# EAGLE design Wireless_TempSens (EAGLE 9.6.2)
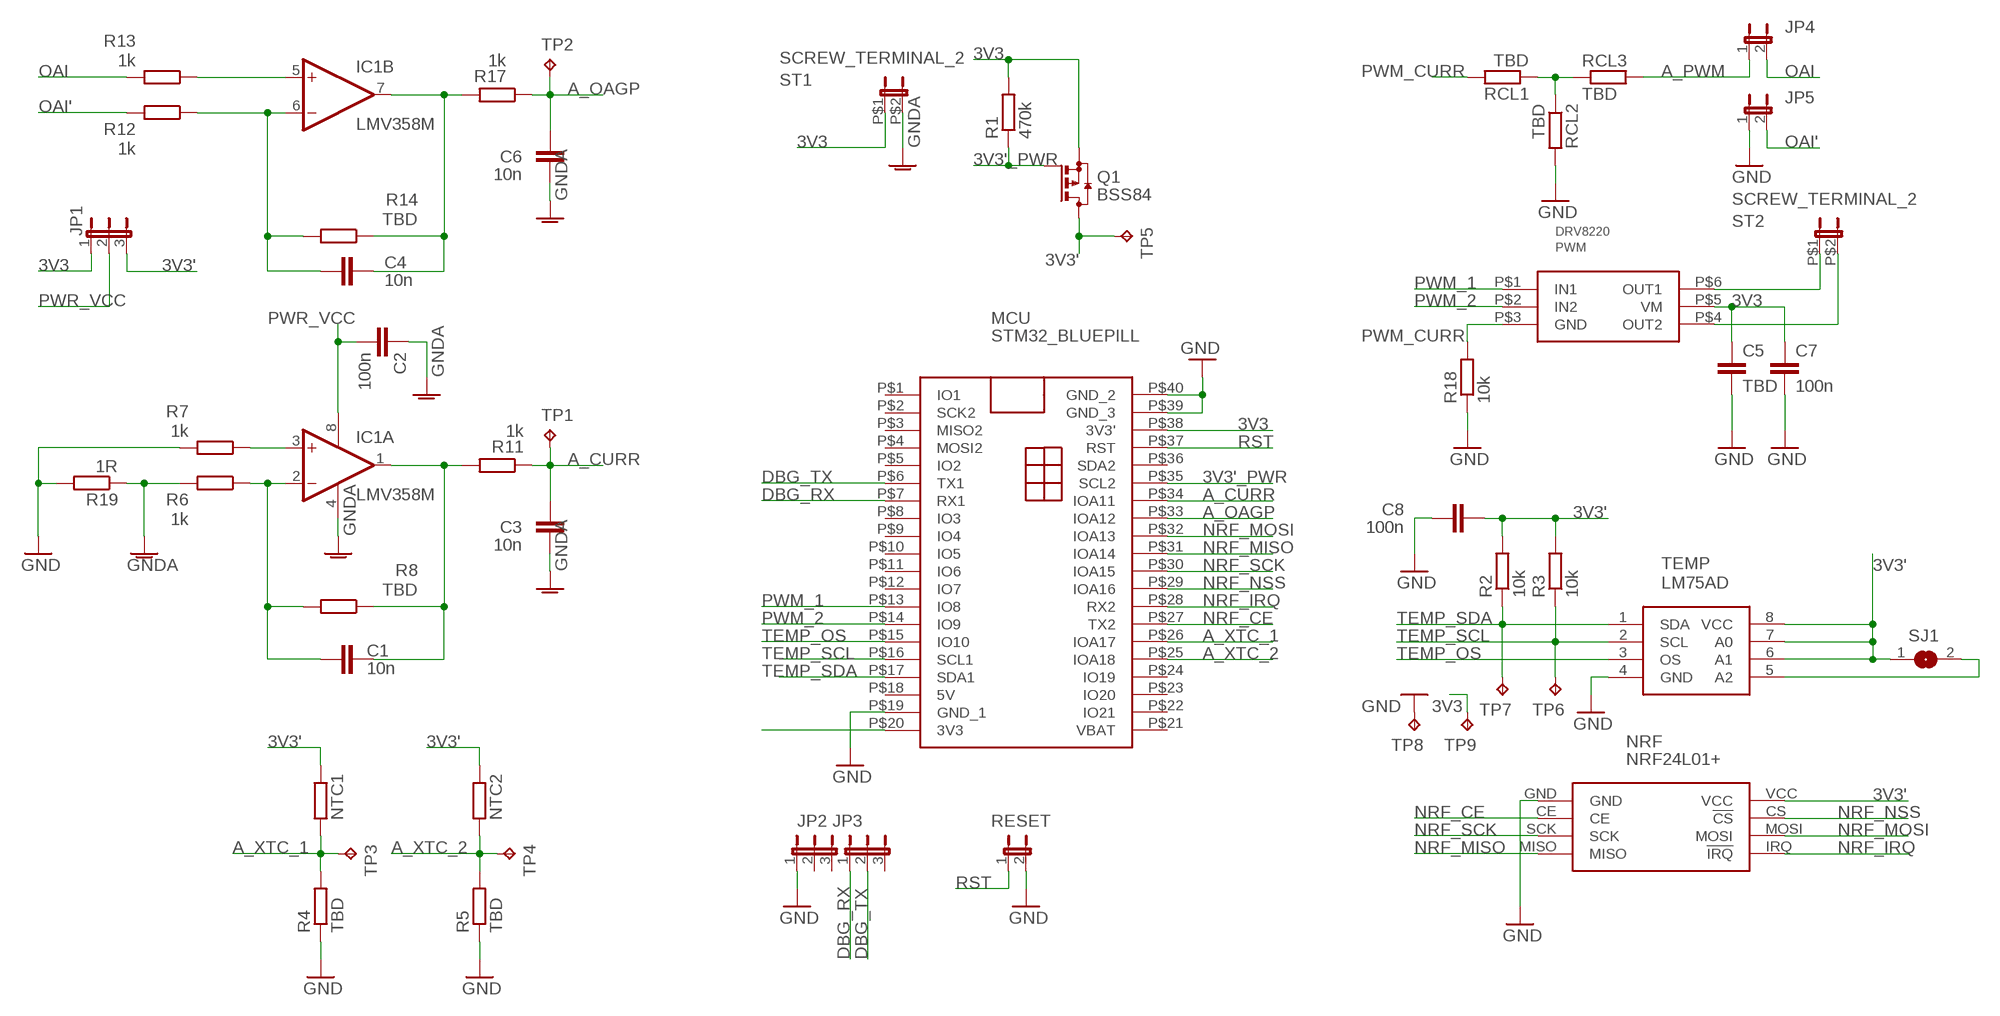
[diagram p0: schematic, sheet 1]

## Parts
C1  10n  C-EUC0805  [C0805]
C2  100n  C-EUC0805  [C0805]
C3  10n  C-EUC0805  [C0805]
C4  10n  C-EUC0805  [C0805]
C5  TBD  C-EUC0805  [C0805]
C6  10n  C-EUC0805  [C0805]
C7  100n  C-EUC0805  [C0805]
C8  100n  C-EUC0805  [C0805]
IC1  LMV358M  [SO08]
JP1  JP2E  [JP2]
JP2  JP2E  [JP2]
JP3  JP2E  [JP2]
JP4  JP1E  [JP1]
JP5  JP1E  [JP1]
MCU  STM32_BLUEPILL  [STM32_BLUEPILL]
NRF  NRF24L01+  [NRF24L01+]
NTC1  R-EU_0204/5  [0204/5]
NTC2  R-EU_0204/5  [0204/5]
PWM  DRV8220  [SOT-5X3]
Q1  BSS84  [SOT23]
R1  470k  R-EU_R0805  [R0805]
R2  10k  R-EU_R0805  [R0805]
R3  10k  R-EU_R0805  [R0805]
R4  TBD  R-EU_R0805  [R0805]
R5  TBD  R-EU_R0805  [R0805]
R6  1k  R-EU_R0805  [R0805]
R7  1k  R-EU_R0805  [R0805]
R8  TBD  R-EU_R0805  [R0805]
R11  1k  R-EU_R0805  [R0805]
R12  1k  R-EU_R0805  [R0805]
R13  1k  R-EU_R0805  [R0805]
R14  TBD  R-EU_R0805  [R0805]
R17  1k  R-EU_R0805  [R0805]
R18  10k  R-EU_R0805  [R0805]
R19  1R  R-EU_R0805  [R0805]
RCL1  TBD  R-EU_R0805  [R0805]
RCL2  TBD  R-EU_R0805  [R0805]
RCL3  TBD  R-EU_R0805  [R0805]
RESET  JP1E  [JP1]
SJ1  SJ  [SJ]
ST1  SCREW_TERMINAL_2  [SCREW_TERMIANL_2]
ST2  SCREW_TERMINAL_2  [SCREW_TERMIANL_2]
TEMP  LM75AD  [SOIC8]
TP1  TPPAD1-13  [P1-13]
TP2  TPPAD1-13  [P1-13]
TP3  TPPAD1-13  [P1-13]
TP4  TPPAD1-13  [P1-13]
TP5  TPPAD1-13  [P1-13]
TP6  TPPAD1-13  [P1-13]
TP7  TPPAD1-13  [P1-13]
TP8  TPPAD1-13  [P1-13]
TP9  TPPAD1-13  [P1-13]

## Nets
3V3: C5.1 C7.1 JP1.1 MCU.P$20(3V3) MCU.P$38(3V3') PWM.P$5(VM) Q1.2(S) R1.2 ST1.P$1 TP9.TP
3V3': C8.2 JP1.3 NRF.VCC NTC1.1 NTC2.1 Q1.3(D) R2.2 R3.2 SJ1.1 TEMP.6(A1) TEMP.7(A0) TEMP.8(VCC) TP5.TP
3V3'_PWR: MCU.P$35(SCL2) Q1.1(G) R1.1
A_CURR: C3.2 MCU.P$34(IOA11) R11.1 TP1.TP
A_OAGP: C6.2 MCU.P$33(IOA12) R17.1 TP2.TP
A_PWM: JP4.1 RCL3.2
A_XTC_1: MCU.P$26(IOA17) NTC1.2 R4.2 TP3.TP
A_XTC_2: MCU.P$25(IOA18) NTC2.2 R5.2 TP4.TP
DBG_RX: JP3.1 MCU.P$7(RX1)
DBG_TX: JP3.2 MCU.P$6(TX1)
GND: C5.2 C7.2 C8.1 JP2.1 JP5.1 MCU.P$19(GND_1) MCU.P$39(GND_3) MCU.P$40(GND_2) NRF.GND R4.1 R5.1 R7.2 R18.1 R19.2 RCL2.2 RESET.2 TEMP.4(GND) TP8.TP
GNDA: C2.1 C3.1 C6.1 IC1.4(P:V-) R6.2 R19.1 ST1.P$2
N$1: IC1.3(A:+IN) R7.1
N$2: C1.2 IC1.2(A:-IN) R6.1 R8.2
N$3: C1.1 IC1.1(A:OUT) R8.1 R11.2
N$5: IC1.5(B:+IN) R13.1
N$6: C4.2 IC1.6(B:-IN) R12.1 R14.2
N$7: C4.1 IC1.7(B:OUT) R14.1 R17.2
N$8: SJ1.2 TEMP.5(A2)
N$11: PWM.P$6(OUT1) ST2.P$1
N$12: PWM.P$4(OUT2) ST2.P$2
N$15: RCL1.1 RCL2.1 RCL3.1
NRF_CE: MCU.P$27(TX2) NRF.CE
NRF_IRQ: MCU.P$28(RX2) NRF.IRQ(!IRQ)
NRF_MISO: MCU.P$31(IOA14) NRF.MISO
NRF_MOSI: MCU.P$32(IOA13) NRF.MOSI
NRF_NSS: MCU.P$29(IOA16) NRF.CS(!CS)
NRF_SCK: MCU.P$30(IOA15) NRF.SCK
OAI: JP4.2 R13.2
OAI': JP5.2 R12.2
PWM_1: MCU.P$13(IO8) PWM.P$1(IN1)
PWM_2: MCU.P$14(IO9) PWM.P$2(IN2)
PWM_CURR: PWM.P$3(GND) R18.2 RCL1.2
PWR_VCC: C2.2 IC1.8(P:V+) JP1.2
RST: MCU.P$37(RST) RESET.1
TEMP_OS: MCU.P$15(IO10) TEMP.3(OS)
TEMP_SCL: MCU.P$16(SCL1) R3.1 TEMP.2(SCL) TP6.TP
TEMP_SDA: MCU.P$17(SDA1) R2.1 TEMP.1(SDA) TP7.TP
Unconnected: JP2.2 JP2.3 JP3.3 MCU.P$1(IO1) MCU.P$2(SCK2) MCU.P$3(MISO2) MCU.P$4(MOSI2) MCU.P$5(IO2) MCU.P$8(IO3) MCU.P$9(IO4) MCU.P$10(IO5) MCU.P$11(IO6) MCU.P$12(IO7) MCU.P$18(5V) MCU.P$21(VBAT) MCU.P$22(IO21) MCU.P$23(IO20) MCU.P$24(IO19) MCU.P$36(SDA2)

## Library data of the parts
C1-C8 = rcl:C-EU: CAPACITOR, European symbol; SPICEPREFIX: C
IC1 = linear:LMV358?*: Dual General Purpose, Low Voltage, Rail-to-Rail Output Operational Amplifiers Source: http://www.national.com/mpf/LM/LMV321.html http://www.national.com/dt/lmv_qual.pdf
JP1-JP3 = jumper:JP2E: JUMPER
JP4 JP5 RESET = jumper:JP1E: JUMPER
MCU = VladimirSustek:STM32_BLUEPILL
NRF = zioShield:NRF24L01+
NTC1 NTC2 R1-R8 R11-R14 R17-R19 RCL1-RCL3 = rcl:R-EU_: RESISTOR, European symbol; SPICEPREFIX: R
PWM = zioShield:DRV8220
Q1 = transistor-small-signal:BSS84: P-CHANNEL MOS FET
SJ1 = jumper:SJ: SMD solder JUMPER
ST1 ST2 = uni_dcdc:SCREW_TERMINAL_2
TEMP = VladimirSustek:LM75AD
TP1-TP9 = testpad:TP: Test pad

## Board
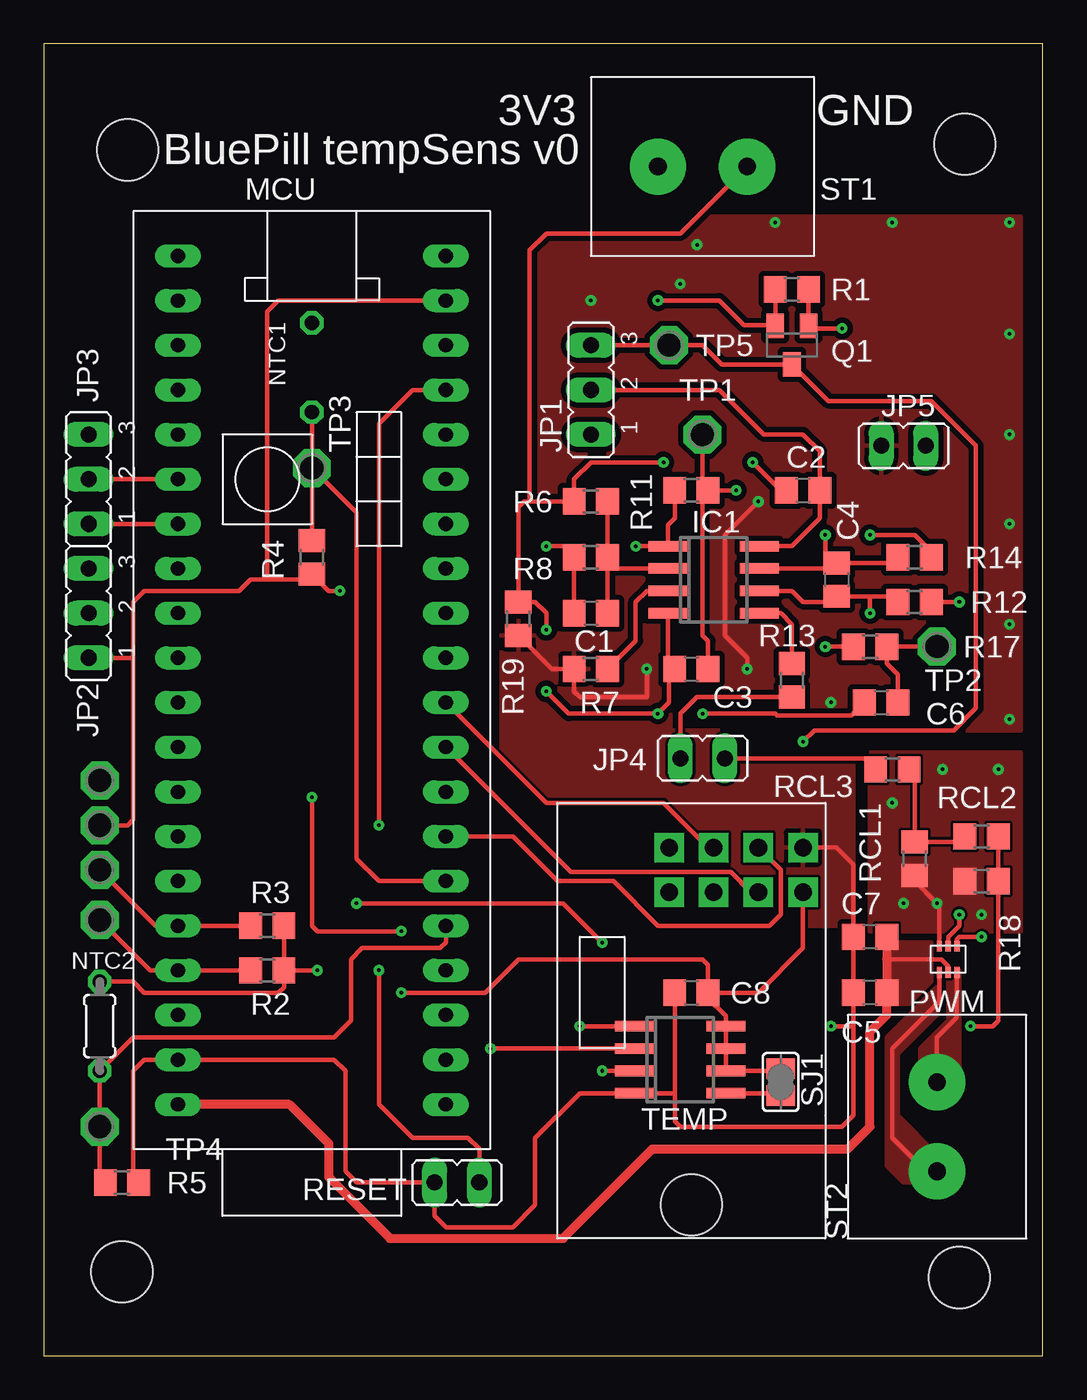
[diagram p1: board, top side]
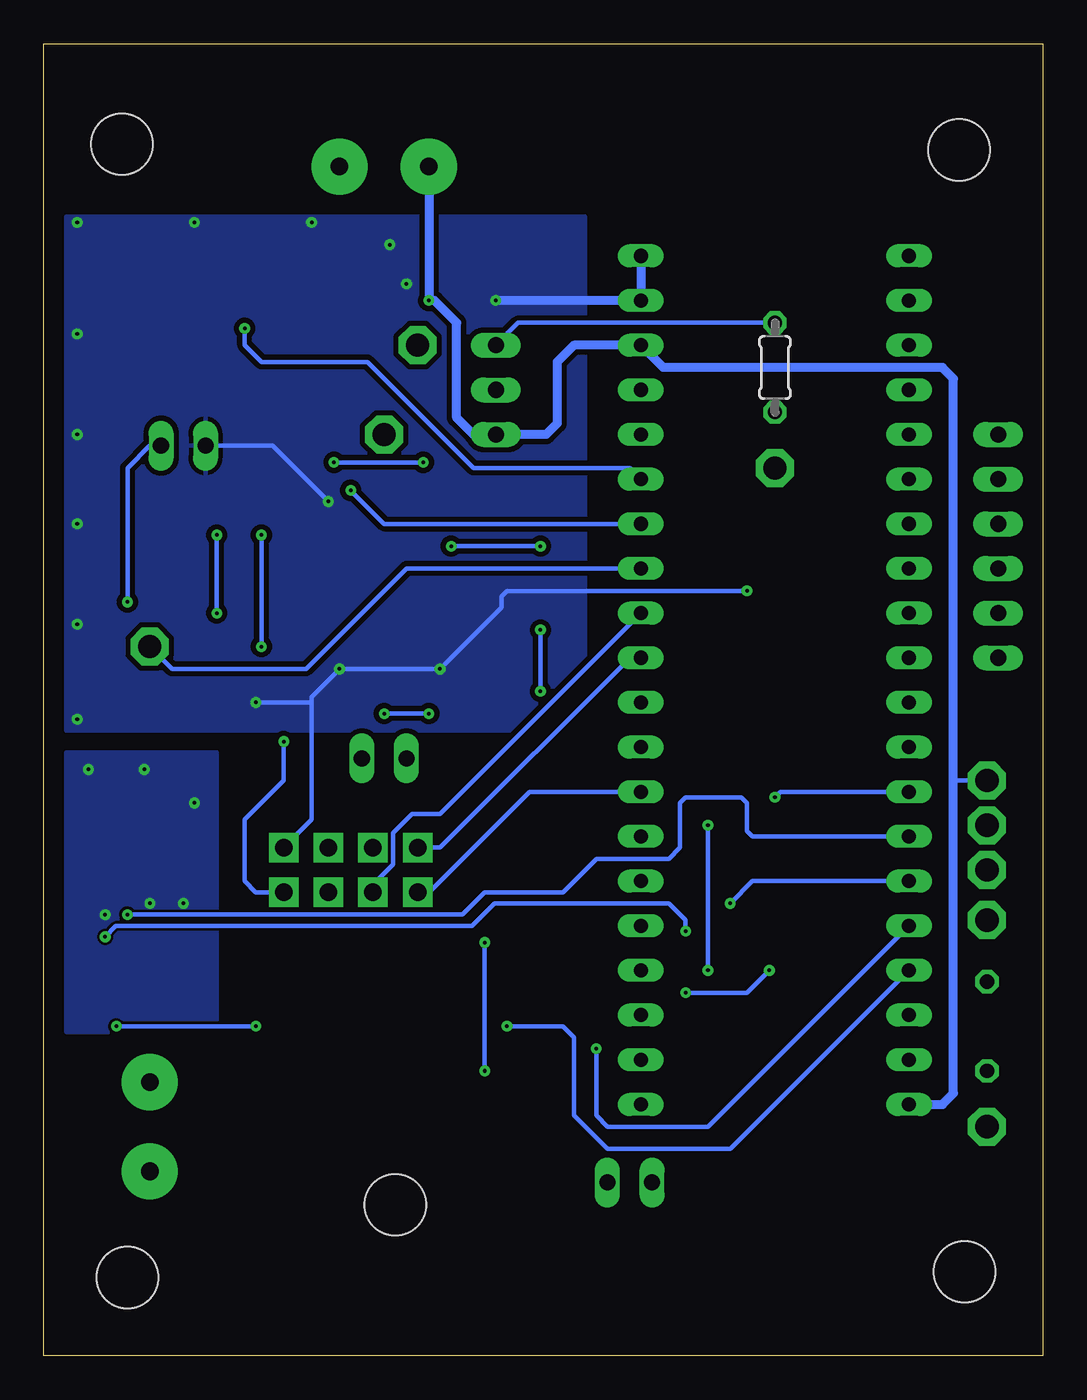
[diagram p2: board, bottom side, seen from below]

Size 56.82 x 74.6 mm. Coordinates in mm from the lower left corner, seen from the top.
Outline: 0,0 56.82,0 56.82,74.6 0,74.6 0,0
Copper layers (1*16): Top 0.035mm / dielectric 1.5mm / Bottom 0.035mm
Design rules "default *": minimum track width 6mil, minimum drill 0.2mm, track to track 6mil, track to pad 6mil, pad to pad 6mil, via to via 6mil, smd to smd 6mil, copper to edge 40mil, drill to drill 6mil, minimum pad ring 10mil, minimum via ring 8mil, stop-mask expansion 4mil, vias tented up to drill 0mil, thermal gap 10mil
Holes 3.5 mm at 52.39,68.9 4.76,68.58 4.45,4.76 52.07,4.45

### Footprints (pad centres in the part's own frame; a part is rotated, then mirrored left to right if it is on the bottom)
C0805 = smd 1.3 x 1.5: 1 -0.95,0; 2 0.95,0
SO08 = smd 0.6 x 2.2: 1 -1.905,-2.6; 2 -0.635,-2.6; 3 0.635,-2.6; 4 1.905,-2.6; 5 1.905,2.6; 6 0.635,2.6; 7 -0.635,2.6; 8 -1.905,2.6
JP2 = drill 0.914 long: 1 -2.54,0; 2 0,0; 3 2.54,0
JP1 = drill 0.914 long: 1 0,-1.27; 2 0,1.27
STM32_BLUEPILL = drill 0.8 long: P$1 -24.13,-7.62; P$2 -21.59,-7.62; P$3 -19.05,-7.62; P$4 -16.51,-7.62; P$5 -13.97,-7.62; P$6 -11.43,-7.62; P$7 -8.89,-7.62; P$8 -6.35,-7.62; P$9 -3.81,-7.62; P$10 -1.27,-7.62; P$11 1.27,-7.62; P$12 3.81,-7.62; P$13 6.35,-7.62; P$14 8.89,-7.62; P$15 11.43,-7.62; P$16 13.97,-7.62; P$17 16.51,-7.62; P$18 19.05,-7.62; P$19 21.59,-7.62; P$20 24.13,-7.62; P$21 24.13,7.62; P$22 21.59,7.62; P$23 19.05,7.62; P$24 16.51,7.62; P$25 13.97,7.62; P$26 11.43,7.62; P$27 8.89,7.62; P$28 6.35,7.62; P$29 3.81,7.62; P$30 1.27,7.62; P$31 -1.27,7.62; P$32 -3.81,7.62; P$33 -6.35,7.62; P$34 -8.89,7.62; P$35 -11.43,7.62; P$36 -13.97,7.62; P$37 -16.51,7.62; P$38 -19.05,7.62; P$39 -21.59,7.62; P$40 -24.13,7.62
NRF24L01+ = drill 1 pad 1.676 square: CE -3.81,-13.97; CS -3.81,-11.43; GND -6.35,-13.97; IRQ 1.27,-11.43; MISO 1.27,-13.97; MOSI -1.27,-11.43; SCK -1.27,-13.97; VCC -6.35,-11.43 | hole 3.5: 0,6.35
0204/5 = drill 0.813 octagon: 1 -2.54,0; 2 2.54,0
SOT-5X3 = smd 0.61 x 0.305: P$1 -0.75,0.5; P$2 -0.75,0; P$3 -0.75,-0.5; P$4 0.75,-0.5; P$5 0.75,0; P$6 0.75,0.5
SOT23 = smd 1 x 1.4: 1 -0.95,-1.1; 2 0.95,-1.1; 3 0,1.1
R0805 = smd 1.3 x 1.5: 1 -0.95,0; 2 0.95,0
SJ = smd 1.168 x 1.6: 1 -0.762,0; 2 0.762,0
SCREW_TERMIANL_2 = drill 1 pad 3.2: P$1 -2.54,0; P$2 2.54,0
SOIC8 = smd 0.6 x 2.2: 1 -1.905,-2.6; 2 -0.635,-2.6; 3 0.635,-2.6; 4 1.905,-2.6; 5 1.905,2.6; 6 0.635,2.6; 7 -0.635,2.6; 8 -1.905,2.6
P1-13 = drill 1.321 pad 2.159 octagon: TP 0,0

### Placement (x,y rotation side)
C1  31.11,42.23 0 top
C2  43.18,49.21 0 top
C3  36.83,39.05 0 top
C4  45.09,44.13 270 top
C5  46.99,20.64 180 top
C6  47.62,37.15 0 top
C7  46.99,23.81 180 top
C8  36.83,20.64 0 top
IC1  38.1,44.13 270 top
JP1  31.11,54.93 90 top
JP2  2.54,42.23 90 top
JP3  2.54,49.85 90 top
JP4  37.47,33.97 90 top
JP5  48.9,51.75 270 top
MCU  15.24,38.42 270 top
NRF  36.83,14.92 180 top
NTC1  15.24,56.2 270 bottom
NTC2  3.17,18.73 270 top
PWM  51.44,22.54 270 top
Q1  42.55,57.47 180 top
R1  42.55,60.64 180 top
R2  12.7,21.91 0 top
R3  12.7,24.45 0 top
R4  15.24,45.4 90 top
R5  4.45,9.84 180 top
R6  31.11,48.58 180 top
R7  31.11,39.05 180 top
R8  31.11,45.4 0 top
R11  36.83,49.21 180 top
R12  49.53,42.86 0 top
R13  42.55,38.42 270 top
R14  49.53,45.4 0 top
R17  46.99,40.32 180 top
R18  53.34,26.99 180 top
R19  26.99,41.91 270 top
RCL1  49.53,28.26 270 top
RCL2  53.34,29.53 0 top
RCL3  48.26,33.34 180 top
RESET  23.5,9.84 90 top
SJ1  41.91,15.56 270 top
ST1  37.47,67.63 0 top
ST2  50.8,13.02 270 top
TEMP  36.2,16.83 270 top
TP1  37.47,52.39 0 top
TP2  50.8,40.32 0 top
TP3  15.24,50.48 0 top
TP4  3.17,13.02 0 top
TP5  35.56,57.47 0 top
TP6  3.17,27.62 0 top
TP7  3.17,24.77 0 top
TP8  3.17,30.16 0 top
TP9  3.17,32.7 0 top

### Tracks (layer width: path | path; a pad name or v marks a point on that pad's centre or on a via)
3V3  (via drill 0.2)
  Top 0.254: 41.63,58.61 Q1.2 | 41.63,58.61 39.81,58.61 38.42,60.01 v34.92,60.01 | R1.2 41.59,58.65 41.63,58.61 | PWM.P$5 51.44,22.14 51.04,22.54 47.94,22.54
  Top 0.508: MCU.P$20 13.97,14.29 16.19,12.06 16.19,10.16 19.68,6.67 29.53,6.67 34.61,11.75 45.72,11.75 46.99,13.02 46.99,18.41 47.94,19.36 C5.1 47.94,22.54 C7.1
  Bottom 0.254: 5.08,32.7 TP9.TP
  Bottom 0.508: ST1.P$1 v34.92,60.01 34.61,60.01 33.34,58.74 33.34,53.34 32.38,52.39 JP1.1 28.26,52.39 27.62,53.02 27.62,56.52 26.67,57.47 MCU.P$38 21.59,56.2 5.71,56.2 5.08,55.56 5.08,32.7 5.08,14.92 5.71,14.29 MCU.P$20
  pour Top (no thermals): 47.94,23.5 50.48,23.5 50.48,21.27 49.21,20 47.94,20
3V3'  (via drill 0.2)
  Top 0.254: JP1.3 TP5.TP 37.47,57.47 38.56,56.37 Q1.3 44.62,54.29 50.48,54.29 53.02,51.75 53.02,36.83 51.75,35.56 43.81,35.56 v43.18,34.92 | R3.2 R2.2 | C8.2 37.78,20.32 38.8,19.31 TEMP.8 TEMP.7 TEMP.6 41.78,16.19 SJ1.1 | NTC2.1 5.08,21.27 5.71,20.64 13.34,20.64 13.65,20.95 R2.2 | NRF.VCC 43.18,23.18 40.64,20.64 C8.2 | C8.2 37.78,22.23 37.47,22.54 26.99,22.54 25.08,20.64 v20.32,20.64 | R2.2 v15.56,21.91
  Bottom 0.254: v15.56,21.91 16.83,20.64 v20.32,20.64 | v43.18,34.92 43.18,32.7 45.4,30.48 45.4,26.99 44.77,26.35 NRF.VCC | JP1.3 29.84,58.74 NTC1.1
3V3'_PWR  (via drill 0.2)
  Top 0.254: R1.1 Q1.1 43.64,58.42 v45.4,58.42
  Bottom 0.254: MCU.P$35 23.5,50.48 32.38,50.48 38.42,56.52 44.45,56.52 45.4,57.47 v45.4,58.42
A_CURR  (via drill 0.2)
  Top 0.254: C3.2 37.78,40.64 37.47,40.96 37.47,48.9 R11.1 | R11.1 37.47,49.53 TP1.TP | R11.1 v39.37,49.21
  Bottom 0.254: v39.37,49.21 37.47,47.31 MCU.P$34
A_OAGP
  Top 0.254: TP2.TP R17.1 47.94,39.37 48.58,38.74 C6.2
  Bottom 0.254: MCU.P$33 36.2,44.77 41.91,39.05 49.53,39.05 TP2.TP
A_PWM
  Top 0.254: JP4.1 46.67,33.97 RCL3.2
A_XTC_1
  Top 0.254: TP3.TP 17.78,47.94 17.78,28.26 19.05,26.99 MCU.P$26 | TP3.TP R4.2 | NTC1.2 TP3.TP
A_XTC_2
  Top 0.254: R5.2 3.17,10.16 TP4.TP NTC2.2 5.08,18.1 16.51,18.1 17.46,19.05 17.46,22.54 18.1,23.18 22.54,23.18 22.86,23.5 MCU.P$25
DBG_RX
  Top 0.254: JP3.1 MCU.P$7
DBG_TX
  Top 0.254: JP3.2 MCU.P$6
GND  (via drill 0.2)
  Top 0.254: v40.64,48.58 38.73,46.67 38.73,40.96 40.01,39.69 v40.01,39.05 | 12.7,45.09 | 12.7,44.13 14.92,44.13 R4.1 16.2,43.5 v16.83,43.5 | 12.7,44.13 11.75,44.13 11.11,43.5 5.71,43.5 5.08,42.86 5.08,39.69 | MCU.P$39 13.34,60.01 12.7,59.37 12.7,45.09 | R5.1 5.08,10.16 5.08,16.19 5.71,16.83 MCU.P$19 16.51,16.83 17.14,16.19 17.14,10.48 17.78,9.84 RESET.2 22.23,7.94 22.86,7.3 26.67,7.3 27.94,8.57 27.94,12.38 30.48,14.92 TEMP.4 35.88,14.92 | C8.1 35.88,14.92 | 35.88,14.92 35.88,13.33 36.2,13.02 45.4,13.02 46.04,13.65 46.04,17.78 46.04,18.73 | 46.04,18.73 C5.2 C7.2 46.04,27.94 45.09,28.89 NRF.GND | v52.7,18.73 53.98,18.73 54.29,19.05 R18.1 RCL2.2 | v44.77,18.73 46.04,18.73 | R19.2 28.89,39.05 R7.2 30.16,37.78 30.48,37.47 34.29,37.47 v34.29,39.05 | TP8.TP 4.76,30.16 5.08,30.48 5.08,39.69 | JP2.1 5.08,39.69 | 12.7,45.09 12.7,44.13
  Bottom 0.254: v44.77,18.73 v52.7,18.73 | NRF.GND 41.59,30.48 41.59,37.15 | 41.59,37.15 41.59,37.47 v40.01,39.05 v34.29,39.05 30.8,42.55 30.8,43.18 30.48,43.5 v16.83,43.5 | v44.77,37.15 41.59,37.15 | JP5.1 43.81,51.75 v40.64,48.58
  Bottom 0.508: v31.11,60.01 MCU.P$39 MCU.P$40
  other vias: 54.93,64.45 54.93,58.1 48.26,64.45 54.93,36.2 54.93,41.59 54.93,47.31 54.93,52.39 41.59,64.45 37.15,63.18 36.2,60.96
  pour Top (isolate 0.3): 55.56,35.56 26.04,35.56 26.04,64.77 55.56,64.77
  pour Bottom (isolate 0.3): 26.04,35.56 55.56,35.56 55.56,64.77 26.04,64.77
  pour Top: 46.04,35.56 46.04,24.45 26.04,24.45 26.04,35.56
GNDA  (via drill 0.2)
  Top 0.254: ST1.P$2 36.2,63.82 28.57,63.82 27.62,62.87 27.62,48.58 | 27.62,48.58 R6.2 30.16,49.85 31.11,50.8 v35.24,50.8 | 27.62,48.58 27.3,48.58 26.99,48.26 R19.1 27.94,42.86 28.57,42.23 v28.57,41.27 | IC1.4 35.5,39.43 C3.1 35.56,38.73 35.56,37.15 v34.92,36.51 29.84,36.51 v28.57,37.78 | v40.32,50.8 41.91,49.21 C2.1 | v37.47,36.51 41.6,36.51 41.7,36.41 45.94,36.41 C6.1
  Bottom 0.254: v28.57,37.78 v28.57,41.27 | v35.24,50.8 v40.32,50.8 | v34.92,36.51 v37.47,36.51
N$1
  Top 0.254: R7.1 33.66,40.64 33.66,42.86 34.29,43.5 IC1.3
N$2
  Top 0.254: 32.06,44.77 R8.2 R6.1 | 32.06,44.77 C1.2 | IC1.2 32.06,44.77
N$3  (via drill 0.2)
  Top 0.254: C1.1 R8.1 29.53,46.04 v28.57,46.04 | R11.2 35.88,47.63 35.5,47.25 IC1.1 v33.66,46.04
  Bottom 0.254: v33.66,46.04 v28.57,46.04
N$5
  Top 0.254: IC1.5 41.91,42.23 42.55,41.59 R13.1
N$6  (via drill 0.2)
  Top 0.254: IC1.6 42.55,43.5 43.18,42.86 44.77,42.86 C4.2 46.99,43.18 | R12.1 48.26,43.18 46.99,43.18 | 46.99,43.18 v46.99,42.23 | v46.99,46.67 49.53,46.67 50.48,45.72 R14.2
  Bottom 0.254: v46.99,42.23 v46.99,46.67
N$7  (via drill 0.2)
  Top 0.254: IC1.7 44.45,44.77 | 44.45,44.77 44.77,44.77 C4.1 48.26,45.08 R14.1 | R17.2 v44.45,40.32 | v44.45,46.67 44.45,44.77
  Bottom 0.254: v44.45,40.32 v44.45,46.67
N$8
  Top 0.254: TEMP.5 41.78,14.92 SJ1.2
N$11
  Top 0.254: PWM.P$6 51.94,19.23 50.8,18.1 ST2.P$1
  pour Top (no thermals): 52.07,21.91 51.44,21.27 51.44,19.05 49.85,17.46 49.85,15.56 51.75,15.56 52.07,15.88
N$12
  Top 0.254: PWM.P$4 50.94,20.14 48.26,17.46 48.26,12.38 50.16,10.48 ST2.P$2
  pour Top (no thermals): 50.8,20.95 47.94,18.1 47.94,10.79 48.9,9.84 50.8,9.84 50.8,11.43 48.58,13.65 48.58,17.14 50.8,19.37
N$15
  Top 0.254: RCL2.1 52.07,29.21 RCL1.1 49.53,33.02 RCL3.1
NRF_CE
  Top 0.254: NRF.CE 41.91,27.62 41.91,25.08 41.27,24.45 34.92,24.45 32.38,26.99 29.21,26.99 26.67,29.53 MCU.P$27
NRF_IRQ
  Bottom 0.254: NRF.IRQ 34.92,26.35 29.21,32.07 MCU.P$28
NRF_MISO
  Bottom 0.254: MCU.P$31 23.5,39.69 34.29,28.89 NRF.MISO
NRF_MOSI
  Bottom 0.254: MCU.P$32 34.29,30.8 35.88,30.8 36.96,29.72 36.96,27.93 38.1,26.79 NRF.MOSI
NRF_NSS
  Top 0.254: NRF.CS 40.21,26.35 39.06,27.5 29.97,27.5 MCU.P$29
NRF_SCK
  Top 0.254: MCU.P$30 28.57,31.43 35.24,31.43 37.78,28.89 NRF.SCK
OAI
  Top 0.254: JP4.2 36.2,36.51 37.15,37.47 R13.2
OAI'  (via drill 0.2)
  Top 0.254: R12.2 v52.07,42.86
  Bottom 0.254: v52.07,42.86 52.07,50.48 50.8,51.75 JP5.2
PWM_1  (via drill 0.2)
  Top 0.254: PWM.P$1 51.94,23.68 52.07,23.81 v53.34,23.81 | v15.24,31.75 15.24,24.45 15.56,24.13 v20.32,24.13
  Bottom 0.254: v20.32,24.13 20.32,24.77 21.27,25.72 31.18,25.72 32.47,24.43 52.73,24.43 v53.34,23.81 | MCU.P$13 14.92,32.07 v15.24,31.75
PWM_2  (via drill 0.2)
  Top 0.254: PWM.P$2 51.44,23.81 52.07,24.45 v52.07,25.08
  Bottom 0.254: v52.07,25.08 33.02,25.08 31.75,26.35 27.3,26.35 25.4,28.26 21.27,28.26 20.64,28.89 20.64,31.43 20.32,31.75 17.14,31.75 16.83,31.43 16.83,29.84 16.51,29.53 MCU.P$14
PWM_CURR  (via drill 0.2)
  Top 0.254: PWM.P$3 50.94,25.58 v50.8,25.72 49.53,26.99 RCL1.2
  other vias: 51.12,33.34 54.29,33.34 48.26,31.43 53.34,25.08 48.9,25.72
  pour Top (no thermals): 46.99,34.29 46.99,24.13 55.56,24.13 55.56,34.29
  pour Bottom: 55.56,34.29 55.56,18.41 46.99,18.41 46.99,34.29
PWR_VCC
  Top 0.254: IC1.8 42.55,46.04 44.13,47.62 C2.2 44.13,51.44 43.18,52.39 40.96,52.39 38.42,54.93 JP1.2
RST  (via drill 0.2)
  Top 0.254: MCU.P$37 20.95,54.93 19.05,53.02 v19.05,30.16 | v19.05,21.91 19.05,14.29 20.95,12.38 24.13,12.38 24.77,11.75 RESET.1
  Bottom 0.254: v19.05,30.16 v19.05,21.91
TEMP_OS  (via drill 0.2)
  Top 0.254: TEMP.3 v31.75,16.19 | v17.78,25.72 29.53,25.72 v31.75,23.5
  Bottom 0.254: MCU.P$15 16.51,26.99 v17.78,25.72 | v31.75,23.5 v31.75,16.19
TEMP_SCL  (via drill 0.2)
  Top 0.254: R3.1 MCU.P$16 6.35,24.45 TP6.TP | TEMP.2 v25.4,17.46
  Bottom 0.254: MCU.P$16 19.05,13.02 24.77,13.02 25.4,13.65 v25.4,17.46
TEMP_SDA  (via drill 0.2)
  Top 0.254: R2.1 MCU.P$17 6.03,21.91 TP7.TP | TEMP.1 v30.48,18.73
  Bottom 0.254: MCU.P$17 17.78,11.75 24.77,11.75 26.67,13.65 26.67,18.1 27.3,18.73 v30.48,18.73

### Text on the board
tNames: 3V3 GND | BluePill tempSens v0